# Altium schematic sheet RS485.SchDoc
size A4
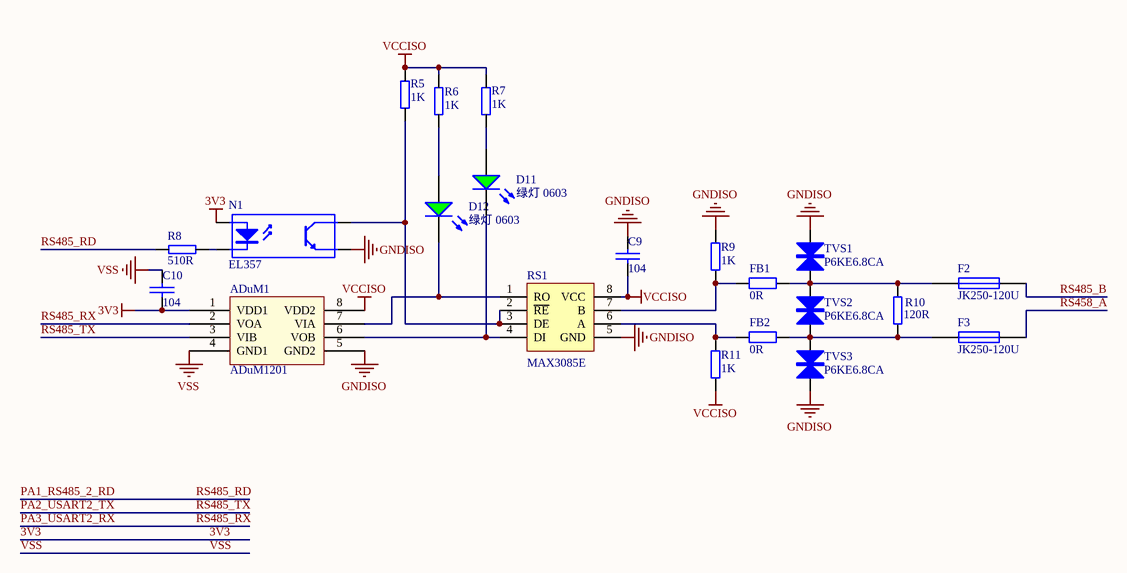
[diagram p0: RS485.SchDoc]

## Parts
ADuM1  ADuM1201  [SOIC-8]
C9  104  [LC-0603_C]
C10  104  [LC-0603_C]
D11  绿灯 0603  [0603_LED_G]
D12  绿灯 0603  [0603_LED_G]
F2  JK250-120U  [ntc250v]
F3  JK250-120U  [ntc250v]
FB1  0R  [LC-0603_L]
FB2  0R  [LC-0603_L]
N1  EL357  [lc-sop-4_P2.54]
R5  1K  [LC-0603_R]
R6  1K  [LC-0603_R]
R7  1K  [LC-0603_R]
R8  510R  [LC-0603_R]
R9  1K  [LC-0603_R]
R10  120R  [LC-0603_R]
R11  1K  [LC-0603_R]
RS1  MAX3085E  [SOIC-8]
TVS1  P6KE6.8CA  [TVS]
TVS2  P6KE6.8CA  [TVS]
TVS3  P6KE6.8CA  [TVS]

## Nets
3V3: ADuM1.1(VDD1) C10.2 N1.1(A)
GNDISO: ADuM1.5(GND2) C9.1 N1.3(E) R9.1 RS1.5(GND) TVS1.2 TVS3.1
VCCISO: ADuM1.8(VDD2) C9.2 R5.1 R6.2 R7.1 R11.2 RS1.8(VCC)
VSS: ADuM1.4(GND1) C10.1
PA1_RS485_2_RD: R8.1  [also labelled RS485_RD]
PA2_USART2_TX: ADuM1.3(VIB)  [also labelled RS485_TX]
PA3_USART2_RX: ADuM1.2(VOA)  [also labelled RS485_RX]
RS458_A: F3.2
RS485_B: F2.2
NetADuM1_6: ADuM1.6(VOB) D11.K RS1.4(DI)
NetADuM1_7: ADuM1.7(VIA) D12.K RS1.1(RO)
NetD11_A: D11.A R7.2
NetD12_A: D12.A R6.1
NetF2_1: F2.1 FB1.1 R10.2 TVS1.1 TVS2.2
NetF3_1: F3.1 FB2.1 R10.1 TVS2.1 TVS3.2
NetFB1_2: FB1.2 R9.2 RS1.7(B)
NetFB2_2: FB2.2 R11.1 RS1.6(A)
NetN1_2: N1.2(K) R8.2
NetN1_4: N1.4(C) R5.2 RS1.2(~{RE}) RS1.3(DE)

## Library data of the parts
C9 C10 = CAP
D11 D12 = 0: 发光二极管; ComponentLink1Descrip: 供应商链接; ComponentLink1URL: http://www.szlcsc.com/product/details_73152.html; Package: 0603; Supplier: LC; SuppliersPartNumber: C72043
F2 F3 = F: 保险丝; Value: 1A
FB1 FB2 = Res2: Resistor; Published: 8-Jun-2000; LatestRevisionDate: 17-Jul-2002; LatestRevisionNote: Re-released for DXP Platform.; PackageReference: AXIAL-0.4; Publisher: Altium Limited; Value: 0R
N1 = ST188: 反射式光电传感器; Published: 24-Mar-1999; LatestRevisionDate: 04-Mar-2005; LatestRevisionNote: Sch pins 3 & 4 Swapped.; DatasheetDocument: Nov-2003; PackageReference: DIP-4; Publisher: Altium Limited
R5-R8 = RES2
R9-R11 = RES
TVS1-TVS3 = TVS